# Altium project Analog_Project_Sem3.PrjPcb
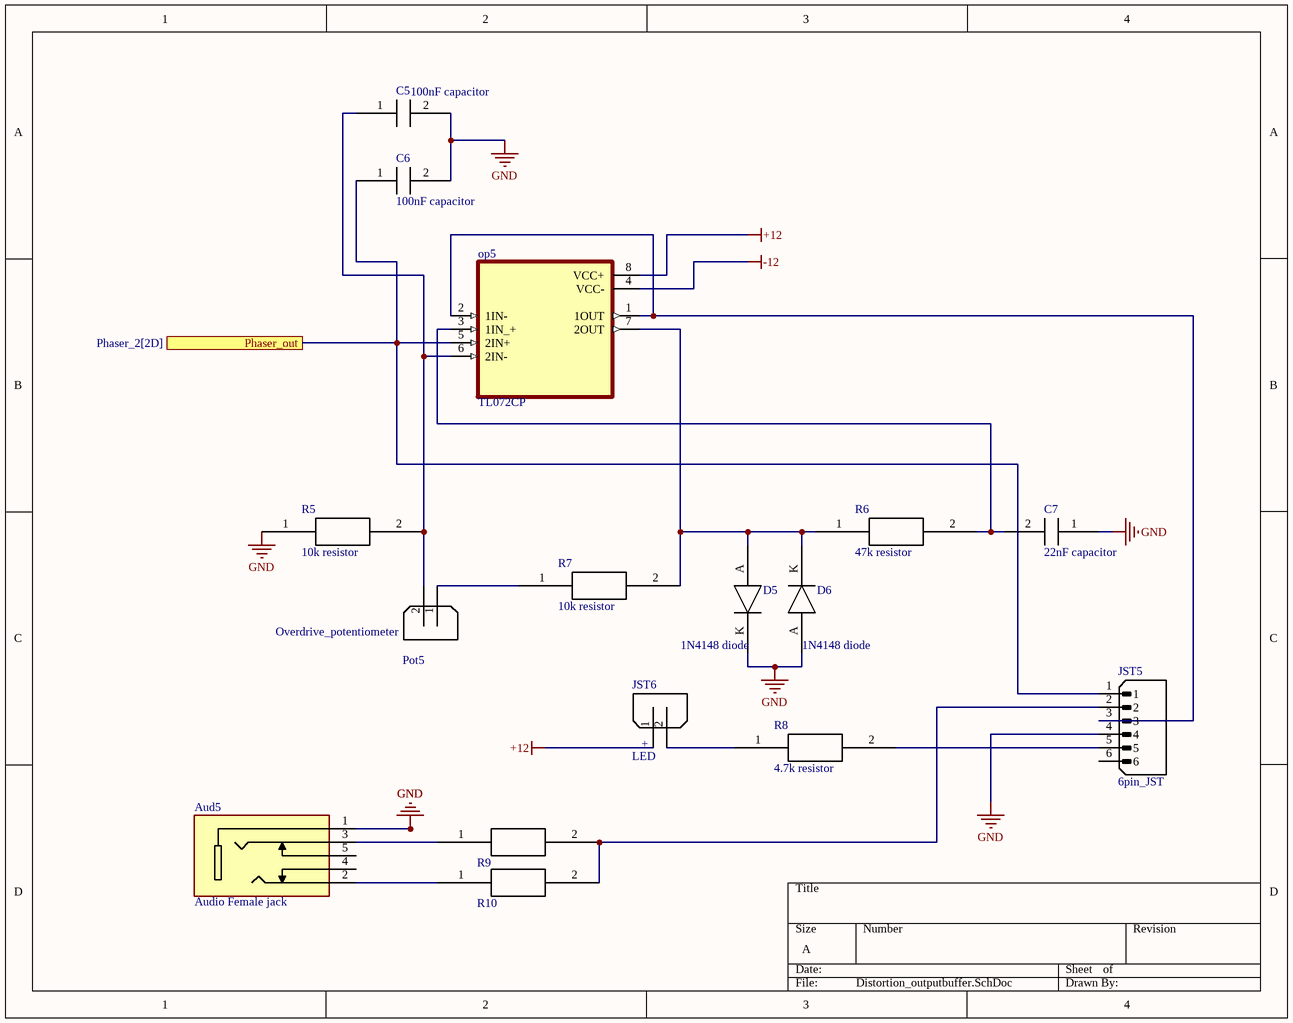
[diagram p0: Distortion_outputbuffer.SchDoc]
5 sheets, 140 parts. Net scope: flat (ports and power ports of the same name join across sheets).
Board file: Analog_Audio_Processor.PcbDoc
Sheets:
  Distortion_outputbuffer.SchDoc
  Tremolo.SchDoc
  Inputbuffer_Equalizer.SchDoc
  Phaser_1.SchDoc
  Phaser_2.SchDoc

## Sheet Distortion_outputbuffer.SchDoc
size A; DocumentNumber: 5; SheetNumber: 5; SheetTotal: 5

### Parts
Aud5  Audio Female jack  [Audio Female Jack]
C5  100nF capacitor  [100nF]
C6  100nF capacitor  [100nF]
C7  22nF capacitor  [22nF]
D5  1N4148 diode  [1N4148]
D6  1N4148 diode  [1N4148]
JST5  6pin_JST  [6pin_JST]
JST6  LED  [2pin_JST]
op5  TL072CP  [TL072CP]
Pot5  Overdrive_potentiometer  [2pin_JST_non_polarized]
R5  10k resistor  [10k]
R6  47k resistor  [47k]
R7  10k resistor  [10k]
R8  4.7k resistor  [4.7k]
R9  100ohm resistor  [100]  (value not drawn)
R10  100ohm resistor  [100]  (value not drawn)

### Ports
Phaser_out (see Phaser_2[2D])

### Nets
+12: JST6.1 op5.8(VCC+)
-12: op5.4(VCC-)
GND: Aud5.1 C5.2 C6.2 C7.1 D5.K D6.A JST5.4 R5.1
NetAud5_2: Aud5.2 R10.1
NetAud5_3: Aud5.3 R9.1
NetC5_1: C5.1 op5.6(2IN-) Pot5.2 R5.2
NetC6_1: C6.1 JST5.1 op5.5(2IN+) ; port Phaser_out
NetC7_2: C7.2 op5.3(1IN_+) R6.2
NetD5_A: D5.A D6.K op5.7(2OUT) R6.1 R7.2
NetJST5_2: JST5.2 R9.2 R10.2
NetJST5_3: JST5.3 op5.1(1OUT) op5.2(1IN-)
NetJST5_5: JST5.5 R8.2
NetJST6_2: JST6.2 R8.1
NetPot5_1: Pot5.1 R7.1

Not connected (* = marked no-connect by the designer): Aud5 4 5; JST5 6

### Notes on the sheet
- (in symbol 2pin_JST) +

### Library data of the parts
JST6 = 2pin_JST
Pot5 = 2pin_jst_non_polarized

## Sheet Tremolo.SchDoc
size A; DocumentNumber: 2; SheetNumber: 2; SheetTotal: 5
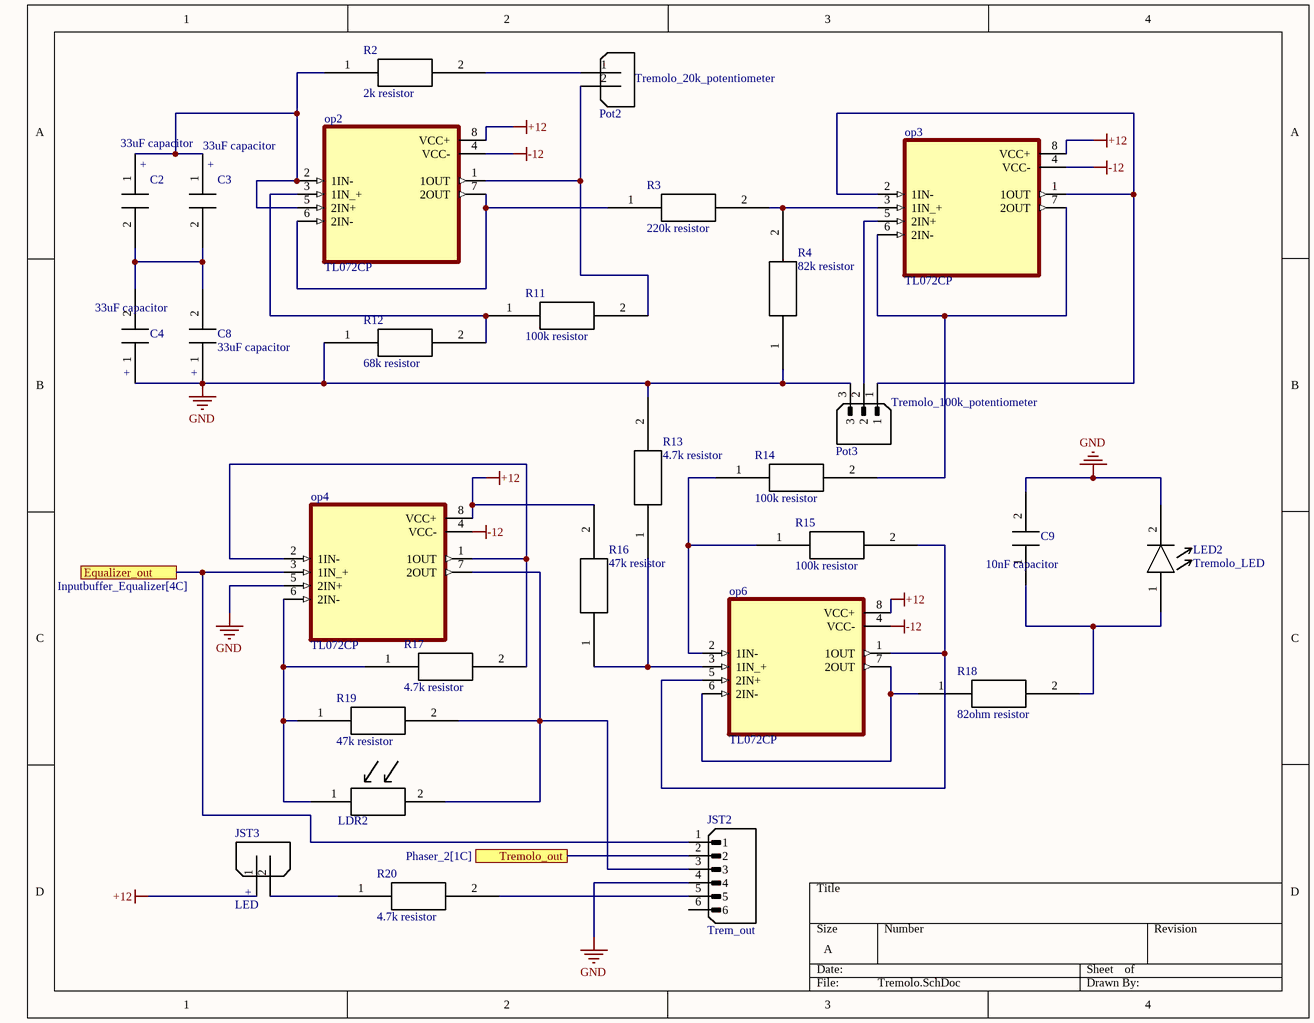
[diagram p1: Tremolo.SchDoc]

### Parts
C2  33uF capacitor  [33uF]
C3  33uF capacitor  [33uF]
C4  33uF capacitor  [33uF]
C8  33uF capacitor  [33uF]
C9  10nF capacitor  [10nF]
JST2  Trem_out  [6pin_JST]
JST3  LED  [2pin_JST]
LDR2  LDR  [LDR]  (value not drawn)
LED2  Tremolo_LED  [LED]
op2  TL072CP  [TL072CP]
op3  TL072CP  [TL072CP]
op4  TL072CP  [TL072CP]
op6  TL072CP  [TL072CP]
Pot2  Tremolo_20k_potentiometer  [2pin_JST_non_polarized]
Pot3  Tremolo_100k_potentiometer  [3pin_jst]
R2  2k resistor  [2k]
R3  220k resistor  [220k]
R4  82k resistor  [82k]
R11  100k resistor  [100k]
R12  68k resistor  [68k]
R13  4.7k resistor  [4.7k]
R14  100k resistor  [100k]
R15  100k resistor  [100k]
R16  47k resistor  [47k]
R17  4.7k resistor  [4.7k]
R18  82ohm resistor  [82]
R19  47k resistor  [47k]
R20  4.7k resistor  [4.7k]

### Ports
Equalizer_out (see Inputbuffer_Equalizer[4C]), Tremolo_out (see Phaser_2[1C])

### Nets
+12: JST3.1 op2.8(VCC+) op3.8(VCC+) op4.8(VCC+) op6.8(VCC+) R16.2
-12: op2.4(VCC-) op3.4(VCC-) op4.4(VCC-) op6.4(VCC-)
GND: C4.1 C8.1 C9.2 JST2.4 LED2.2 op4.5(2IN+) Pot3.3 R4.1 R12.1 R13.2
NetC2_1: C2.1 C3.1 op2.2(1IN-) op2.5(2IN+) R2.1
NetC2_2: C2.2 C3.2 C4.2 C8.2
NetC9_1: C9.1 LED2.1 R18.2
NetC27_1: JST2.2 ; port Tremolo_out
NetJST2_1: JST2.1 op4.3(1IN_+) ; port Equalizer_out
NetJST2_3: JST2.3 LDR2.2 op4.7(2OUT) R19.2
NetJST2_5: JST2.5 R20.2
NetJST3_2: JST3.2 R20.1
NetLDR2_1: LDR2.1 op4.6(2IN-) R17.1 R19.1
Netop2_1: op2.1(1OUT) Pot2.2 R11.2
Netop2_3: op2.3(1IN_+) R11.1 R12.2
Netop2_6: op2.6(2IN-) op2.7(2OUT) R3.1
Netop3_1: op3.1(1OUT) op3.2(1IN-) Pot3.1
Netop3_3: op3.3(1IN_+) R3.2 R4.2
Netop3_5: op3.5(2IN+) Pot3.2
Netop3_6: op3.6(2IN-) op3.7(2OUT) R14.2
Netop4_1: op4.1(1OUT) op4.2(1IN-) R17.2
Netop6_1: op6.1(1OUT) op6.5(2IN+) R15.2
Netop6_2: op6.2(1IN-) R14.1 R15.1
Netop6_3: op6.3(1IN_+) R13.1 R16.1
Netop6_6: op6.6(2IN-) op6.7(2OUT) R18.1
NetPot2_1: Pot2.1 R2.2

Not connected (* = marked no-connect by the designer): JST2 6

### Notes on the sheet
- (in symbol 2pin_JST) +
- (in symbol 33uF capacitor) +

### Library data of the parts
JST2 = 6pin_JST
JST3 = 2pin_JST
LED2 = LED
Pot2 = 2pin_jst_non_polarized
Pot3 = 3pin_jst

## Sheet Inputbuffer_Equalizer.SchDoc
size A; DocumentNumber: 1; SheetNumber: 1; SheetTotal: 5
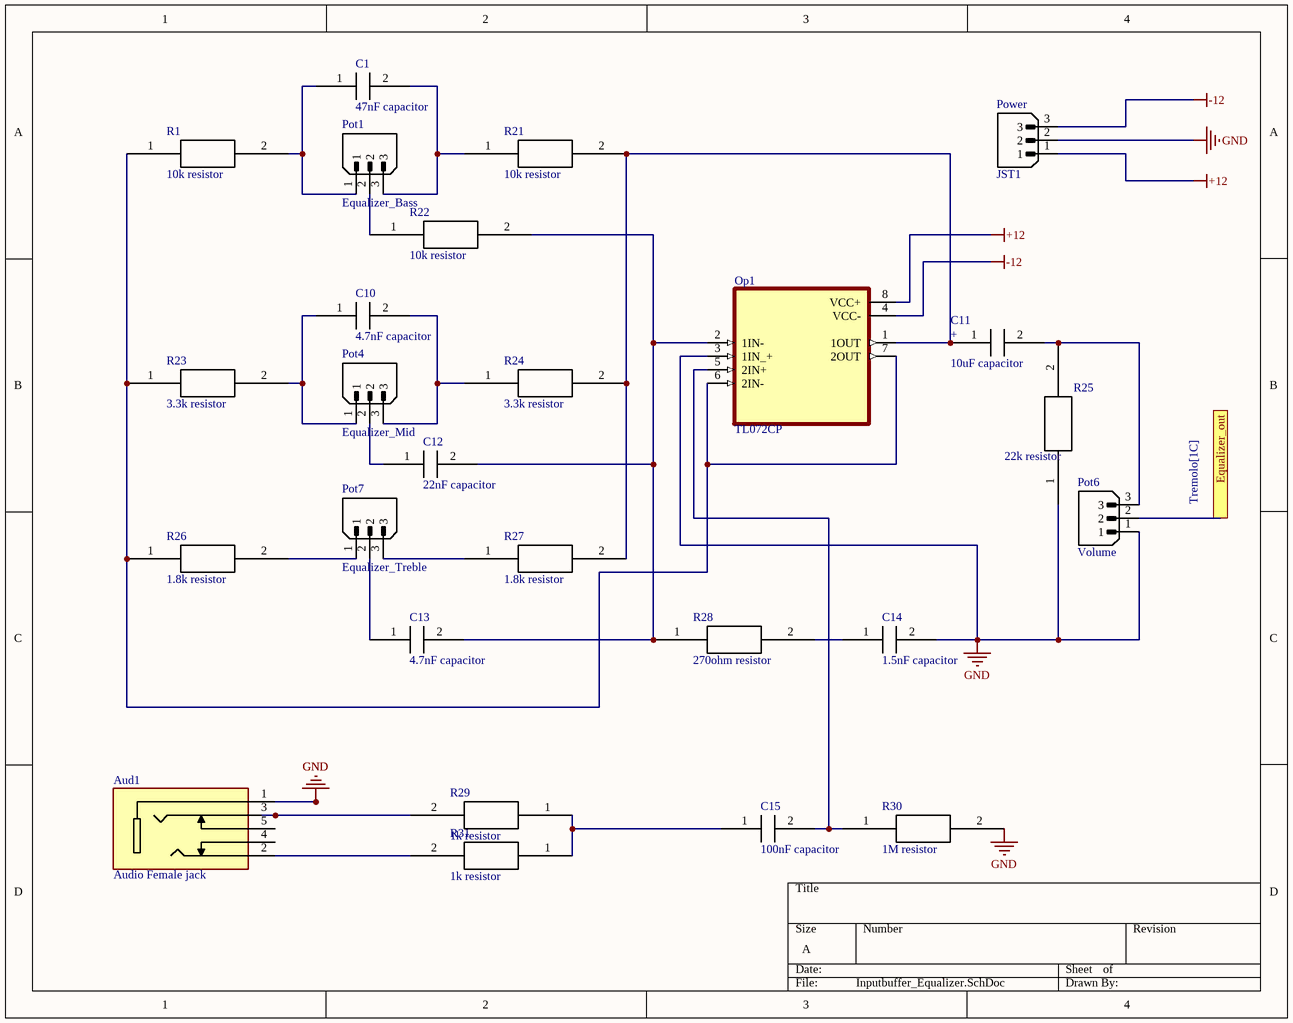
[diagram p2: Inputbuffer_Equalizer.SchDoc]

### Parts
Aud1  Audio Female jack  [Audio Female Jack]
C1  47nF capacitor  [47nF]
C10  4.7nF capacitor  [4.7nF]
C11  10uF capacitor  [10uF]
C12  22nF capacitor  [22nF]
C13  4.7nF capacitor  [4.7nF]
C14  1.5nF capacitor  [1.5nF]
C15  100nF capacitor  [100nF]
JST1  Power  [3pin_jst]
Op1  TL072CP  [TL072CP]
Pot1  Equalizer_Bass  [3pin_jst]
Pot4  Equalizer_Mid  [3pin_jst]
Pot6  Volume  [3pin_jst]
Pot7  Equalizer_Treble  [3pin_jst]
R1  10k resistor  [10k]
R21  10k resistor  [10k]
R22  10k resistor  [10k]
R23  3.3k resistor  [3.3k]
R24  3.3k resistor  [3.3k]
R25  22k resistor  [22k]
R26  1.8k resistor  [1.8k]
R27  1.8k resistor  [1.8k]
R28  270ohm resistor  [270]
R29  1k resistor  [1k]
R30  1M resistor  [1M]
R31  1k resistor  [1k]

### Ports
Equalizer_out (see Tremolo[1C])

### Nets
+12: JST1.1 Op1.8(VCC+)
-12: JST1.3 Op1.4(VCC-)
GND: Aud1.1 C14.2 JST1.2 Op1.3(1IN_+) Pot6.1 R25.1 R30.2
NetAud1_2: Aud1.2 R31.2
NetAud1_3: Aud1.3 R29.2
NetC1_1: C1.1 Pot1.1 R1.2
NetC1_2: C1.2 Pot1.3 R21.1
NetC10_1: C10.1 Pot4.1 R23.2
NetC10_2: C10.2 Pot4.3 R24.1
NetC11_1: C11.1 Op1.1(1OUT) R21.2 R24.2 R27.2
NetC11_2: C11.2 Pot6.3 R25.2
NetC12_1: C12.1 Pot4.2
NetC12_2: C12.2 C13.2 Op1.2(1IN-) R22.2 R28.1
NetC13_1: C13.1 Pot7.2
NetC14_1: C14.1 R28.2
NetC15_1: C15.1 R29.1 R31.1
NetC15_2: C15.2 Op1.5(2IN+) R30.1
NetJST2_1: Pot6.2 ; port Equalizer_out
NetOp1_6: Op1.6(2IN-) Op1.7(2OUT) R1.1 R23.1 R26.1
NetPot1_2: Pot1.2 R22.1
NetPot7_1: Pot7.1 R26.2
NetPot7_3: Pot7.3 R27.1

Not connected (* = marked no-connect by the designer): Aud1 4 5

### Notes on the sheet
- (in symbol 10uF capacitor) +

### Library data of the parts
JST1 Pot1 Pot4 Pot6 Pot7 = 3pin_jst

## Sheet Phaser_1.SchDoc
size A; DocumentNumber: 3; SheetNumber: 3; SheetTotal: 5
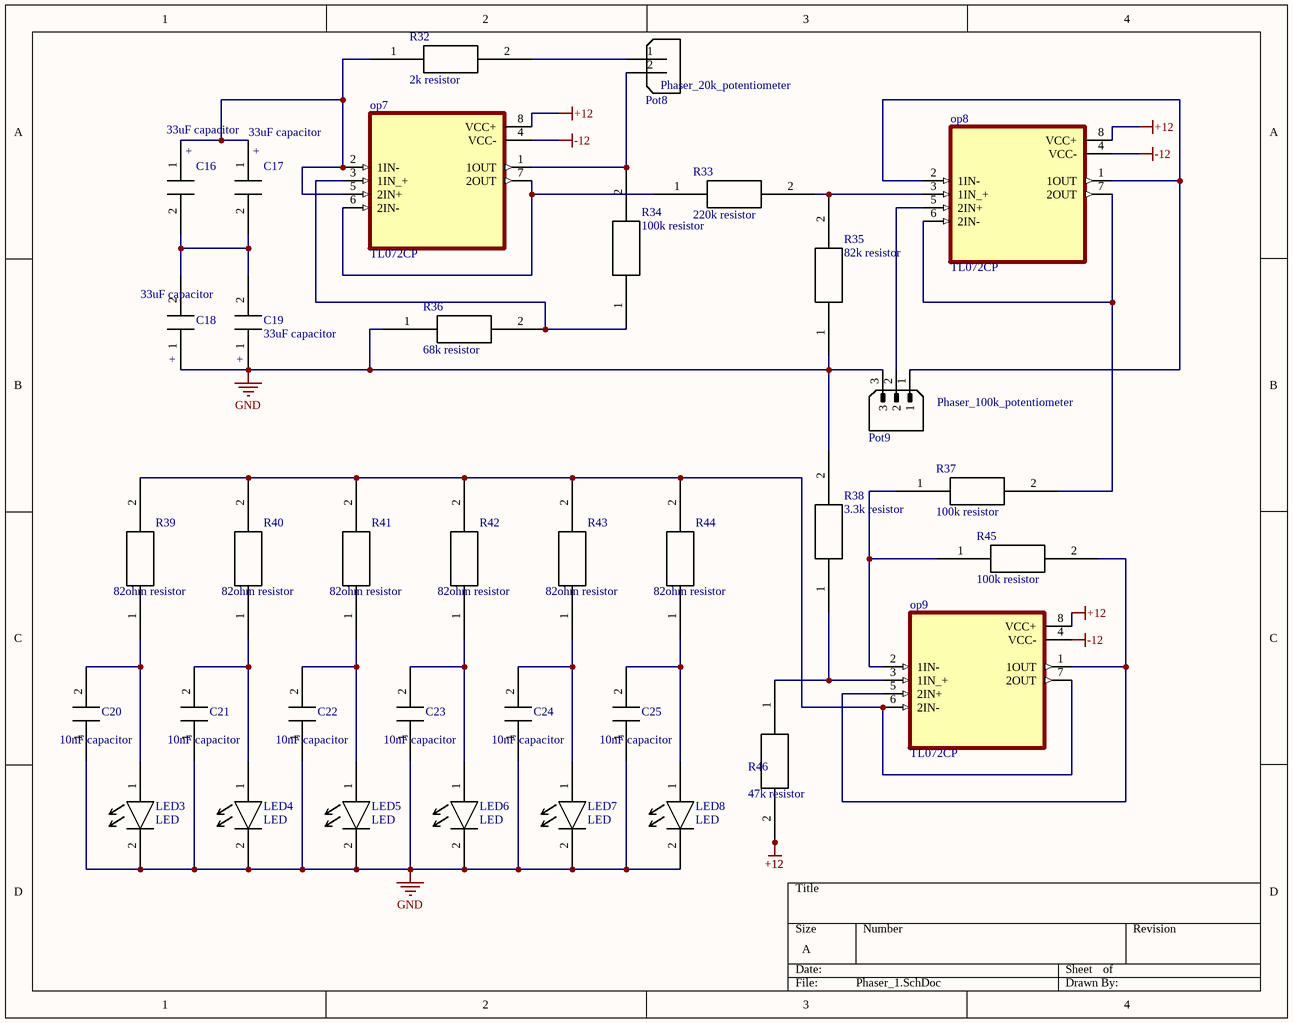
[diagram p3: Phaser_1.SchDoc]

### Parts
C16  33uF capacitor  [33uF]
C17  33uF capacitor  [33uF]
C18  33uF capacitor  [33uF]
C19  33uF capacitor  [33uF]
C20  10nF capacitor  [10nF]
C21  10nF capacitor  [10nF]
C22  10nF capacitor  [10nF]
C23  10nF capacitor  [10nF]
C24  10nF capacitor  [10nF]
C25  10nF capacitor  [10nF]
LED3  LED  [LED]
LED4  LED  [LED]
LED5  LED  [LED]
LED6  LED  [LED]
LED7  LED  [LED]
LED8  LED  [LED]
op7  TL072CP  [TL072CP]
op8  TL072CP  [TL072CP]
op9  TL072CP  [TL072CP]
Pot8  Phaser_20k_potentiometer  [2pin_JST_non_polarized]
Pot9  Phaser_100k_potentiometer  [3pin_jst]
R32  2k resistor  [2k]
R33  220k resistor  [220k]
R34  100k resistor  [100k]
R35  82k resistor  [82k]
R36  68k resistor  [68k]
R37  100k resistor  [100k]
R38  3.3k resistor  [3.3k]
R39  82ohm resistor  [82]
R40  82ohm resistor  [82]
R41  82ohm resistor  [82]
R42  82ohm resistor  [82]
R43  82ohm resistor  [82]
R44  82ohm resistor  [82]
R45  100k resistor  [100k]
R46  47k resistor  [47k]

### Nets
+12: op7.8(VCC+) op8.8(VCC+) op9.8(VCC+) R46.2
-12: op7.4(VCC-) op8.4(VCC-) op9.4(VCC-)
GND: C18.1 C19.1 C20.1 C21.1 C22.1 C23.1 C24.1 C25.1 LED3.2 LED4.2 LED5.2 LED6.2 LED7.2 LED8.2 Pot9.3 R35.1 R36.1 R38.2
NetC16_1: C16.1 C17.1 op7.2(1IN-) op7.5(2IN+) R32.1
NetC16_2: C16.2 C17.2 C18.2 C19.2
NetC20_2: C20.2 LED3.1 R39.1
NetC21_2: C21.2 LED4.1 R40.1
NetC22_2: C22.2 LED5.1 R41.1
NetC23_2: C23.2 LED6.1 R42.1
NetC24_2: C24.2 LED7.1 R43.1
NetC25_2: C25.2 LED8.1 R44.1
Netop7_1: op7.1(1OUT) Pot8.2 R34.2
Netop7_3: op7.3(1IN_+) R34.1 R36.2
Netop7_6: op7.6(2IN-) op7.7(2OUT) R33.1
Netop8_1: op8.1(1OUT) op8.2(1IN-) Pot9.1
Netop8_3: op8.3(1IN_+) R33.2 R35.2
Netop8_5: op8.5(2IN+) Pot9.2
Netop8_6: op8.6(2IN-) op8.7(2OUT) R37.2
Netop9_1: op9.1(1OUT) op9.5(2IN+) R45.2
Netop9_2: op9.2(1IN-) R37.1 R45.1
Netop9_3: op9.3(1IN_+) R38.1 R46.1
Netop9_6: op9.6(2IN-) op9.7(2OUT) R39.2 R40.2 R41.2 R42.2 R43.2 R44.2
NetPot8_1: Pot8.1 R32.2

### Notes on the sheet
- (in symbol 33uF capacitor) +

### Library data of the parts
Pot8 = 2pin_jst_non_polarized
Pot9 = 3pin_jst

## Sheet Phaser_2.SchDoc
size A; DocumentNumber: 4; SheetNumber: 4; SheetTotal: 5
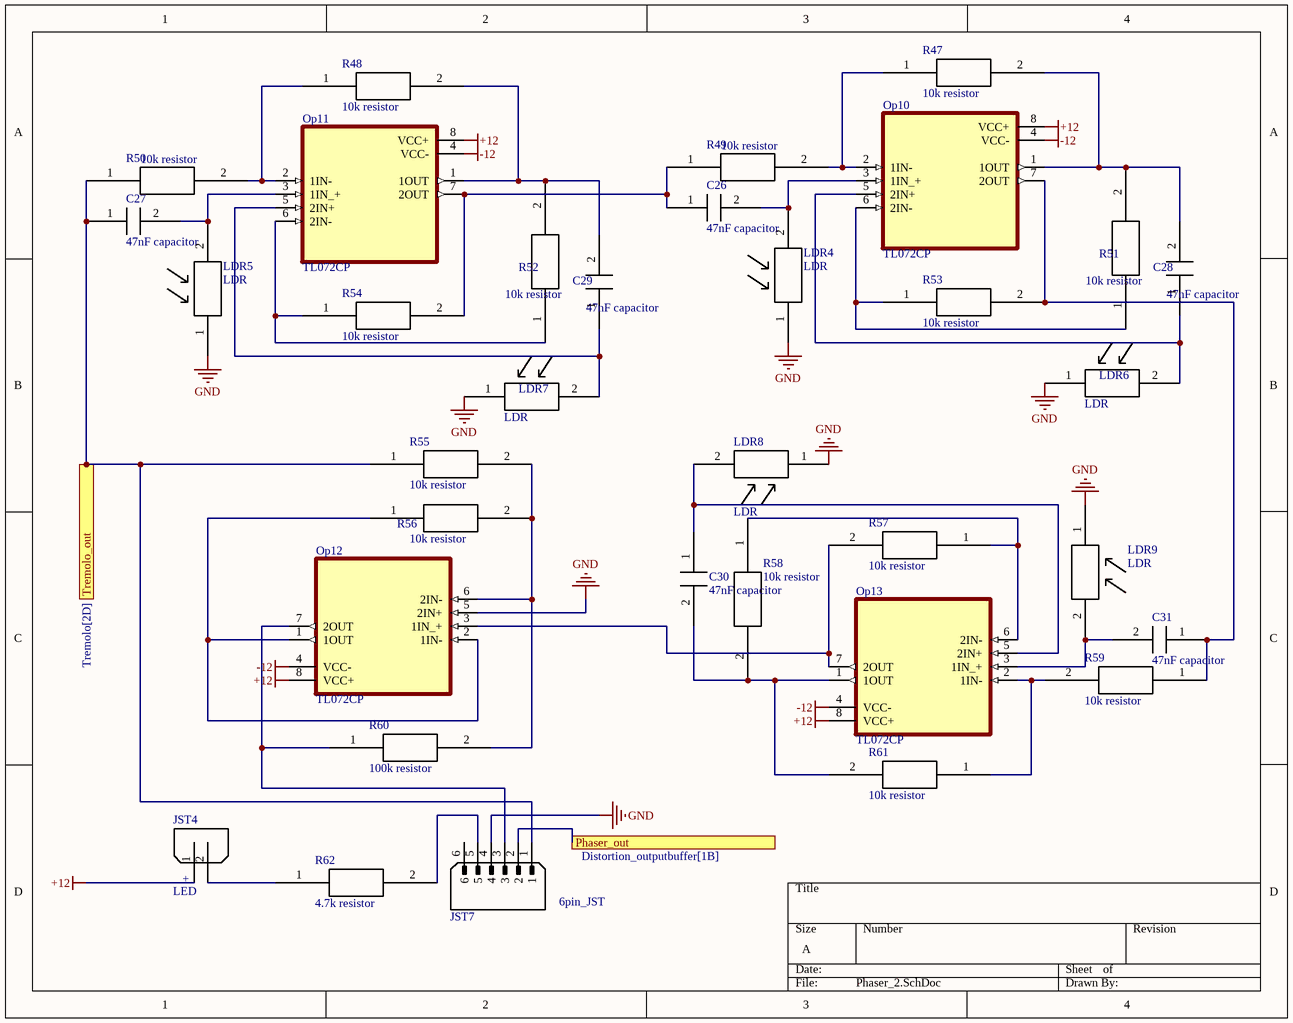
[diagram p4: Phaser_2.SchDoc]

### Parts
C26  47nF capacitor  [47nF]
C27  47nF capacitor  [47nF]
C28  47nF capacitor  [47nF]
C29  47nF capacitor  [47nF]
C30  47nF capacitor  [47nF]
C31  47nF capacitor  [47nF]
JST4  LED  [2pin_JST]
JST7  6pin_JST  [6pin_JST]
LDR4  LDR  [LDR]
LDR5  LDR  [LDR]
LDR6  LDR  [LDR]
LDR7  LDR  [LDR]
LDR8  LDR  [LDR]
LDR9  LDR  [LDR]
Op10  TL072CP  [TL072CP]
Op11  TL072CP  [TL072CP]
Op12  TL072CP  [TL072CP]
Op13  TL072CP  [TL072CP]
R47  10k resistor  [10k]
R48  10k resistor  [10k]
R49  10k resistor  [10k]
R50  10k resistor  [10k]
R51  10k resistor  [10k]
R52  10k resistor  [10k]
R53  10k resistor  [10k]
R54  10k resistor  [10k]
R55  10k resistor  [10k]
R56  10k resistor  [10k]
R57  10k resistor  [10k]
R58  10k resistor  [10k]
R59  10k resistor  [10k]
R60  100k resistor  [100k]
R61  10k resistor  [10k]
R62  4.7k resistor  [4.7k]

### Ports
Phaser_out (see Distortion_outputbuffer[1B]), Tremolo_out (see Tremolo[2D])

### Nets
+12: JST4.1 Op10.8(VCC+) Op11.8(VCC+) Op12.8(VCC+) Op13.8(VCC+)
-12: Op10.4(VCC-) Op11.4(VCC-) Op12.4(VCC-) Op13.4(VCC-)
GND: JST7.4 LDR4.1 LDR5.1 LDR6.1 LDR7.1 LDR8.1 LDR9.1 Op12.5(2IN+)
NetC6_1: JST7.2 ; port Phaser_out
NetC26_1: C26.1 Op11.7(2OUT) R49.1 R54.2
NetC26_2: C26.2 LDR4.2 Op10.3(1IN_+)
NetC27_1: C27.1 JST7.1 R50.1 R55.1 ; port Tremolo_out
NetC27_2: C27.2 LDR5.2 Op11.3(1IN_+)
NetC28_1: C28.1 LDR6.2 Op10.5(2IN+)
NetC28_2: C28.2 Op10.1(1OUT) R47.2 R51.2
NetC29_1: C29.1 LDR7.2 Op11.5(2IN+)
NetC29_2: C29.2 Op11.1(1OUT) R48.2 R52.2
NetC30_1: C30.1 LDR8.2 Op13.5(2IN+)
NetC30_2: C30.2 Op13.1(1OUT) R58.2 R61.2
NetC31_1: C31.1 Op10.7(2OUT) R53.2 R59.1
NetC31_2: C31.2 LDR9.2 Op13.3(1IN_+)
NetJST4_2: JST4.2 R62.1
NetJST7_3: JST7.3 Op12.7(2OUT) R60.1
NetJST7_5: JST7.5 R62.2
NetOp10_2: Op10.2(1IN-) R47.1 R49.2
NetOp10_6: Op10.6(2IN-) R51.1 R53.1
NetOp11_2: Op11.2(1IN-) R48.1 R50.2
NetOp11_6: Op11.6(2IN-) R52.1 R54.1
NetOp12_1: Op12.1(1OUT) Op12.2(1IN-) R56.1
NetOp12_3: Op12.3(1IN_+) Op13.7(2OUT) R57.2
NetOp12_6: Op12.6(2IN-) R55.2 R56.2 R60.2
NetOp13_2: Op13.2(1IN-) R59.2 R61.1
NetOp13_6: Op13.6(2IN-) R57.1 R58.1

Not connected (* = marked no-connect by the designer): JST7 6

### Notes on the sheet
- (in symbol 2pin_JST) +

### Library data of the parts
JST4 = 2pin_JST

## Nets that join several sheets
+12: Distortion_outputbuffer (JST6.1 op5.8), Tremolo (6 pins), Inputbuffer_Equalizer (JST1.1 Op1.8), Phaser_1 (op7.8 op8.8 op9.8 R46.2), Phaser_2 (5 pins)
-12: Distortion_outputbuffer (op5.4), Tremolo (op2.4 op3.4 op4.4 op6.4), Inputbuffer_Equalizer (JST1.3 Op1.4), Phaser_1 (op7.4 op8.4 op9.4), Phaser_2 (Op10.4 Op11.4 Op12.4 Op13.4)
GND: Distortion_outputbuffer (8 pins), Tremolo (10 pins), Inputbuffer_Equalizer (7 pins), Phaser_1 (18 pins), Phaser_2 (8 pins)
NetC6_1: Distortion_outputbuffer (C6.1 JST5.1 op5.5), Phaser_2 (JST7.2)
NetC27_1: Tremolo (JST2.2), Phaser_2 (C27.1 JST7.1 R50.1 R55.1)
NetJST2_1: Tremolo (JST2.1 op4.3), Inputbuffer_Equalizer (Pot6.2)